# Altium schematic sheet CAN-INTERFACESchDoc.SchDoc
size A3; Organization: Altium Limited; Address1: L3, 12a Rodborough Rd; Address2: Frenchs Forest; Address3: NSW; Address4: Australia 2086
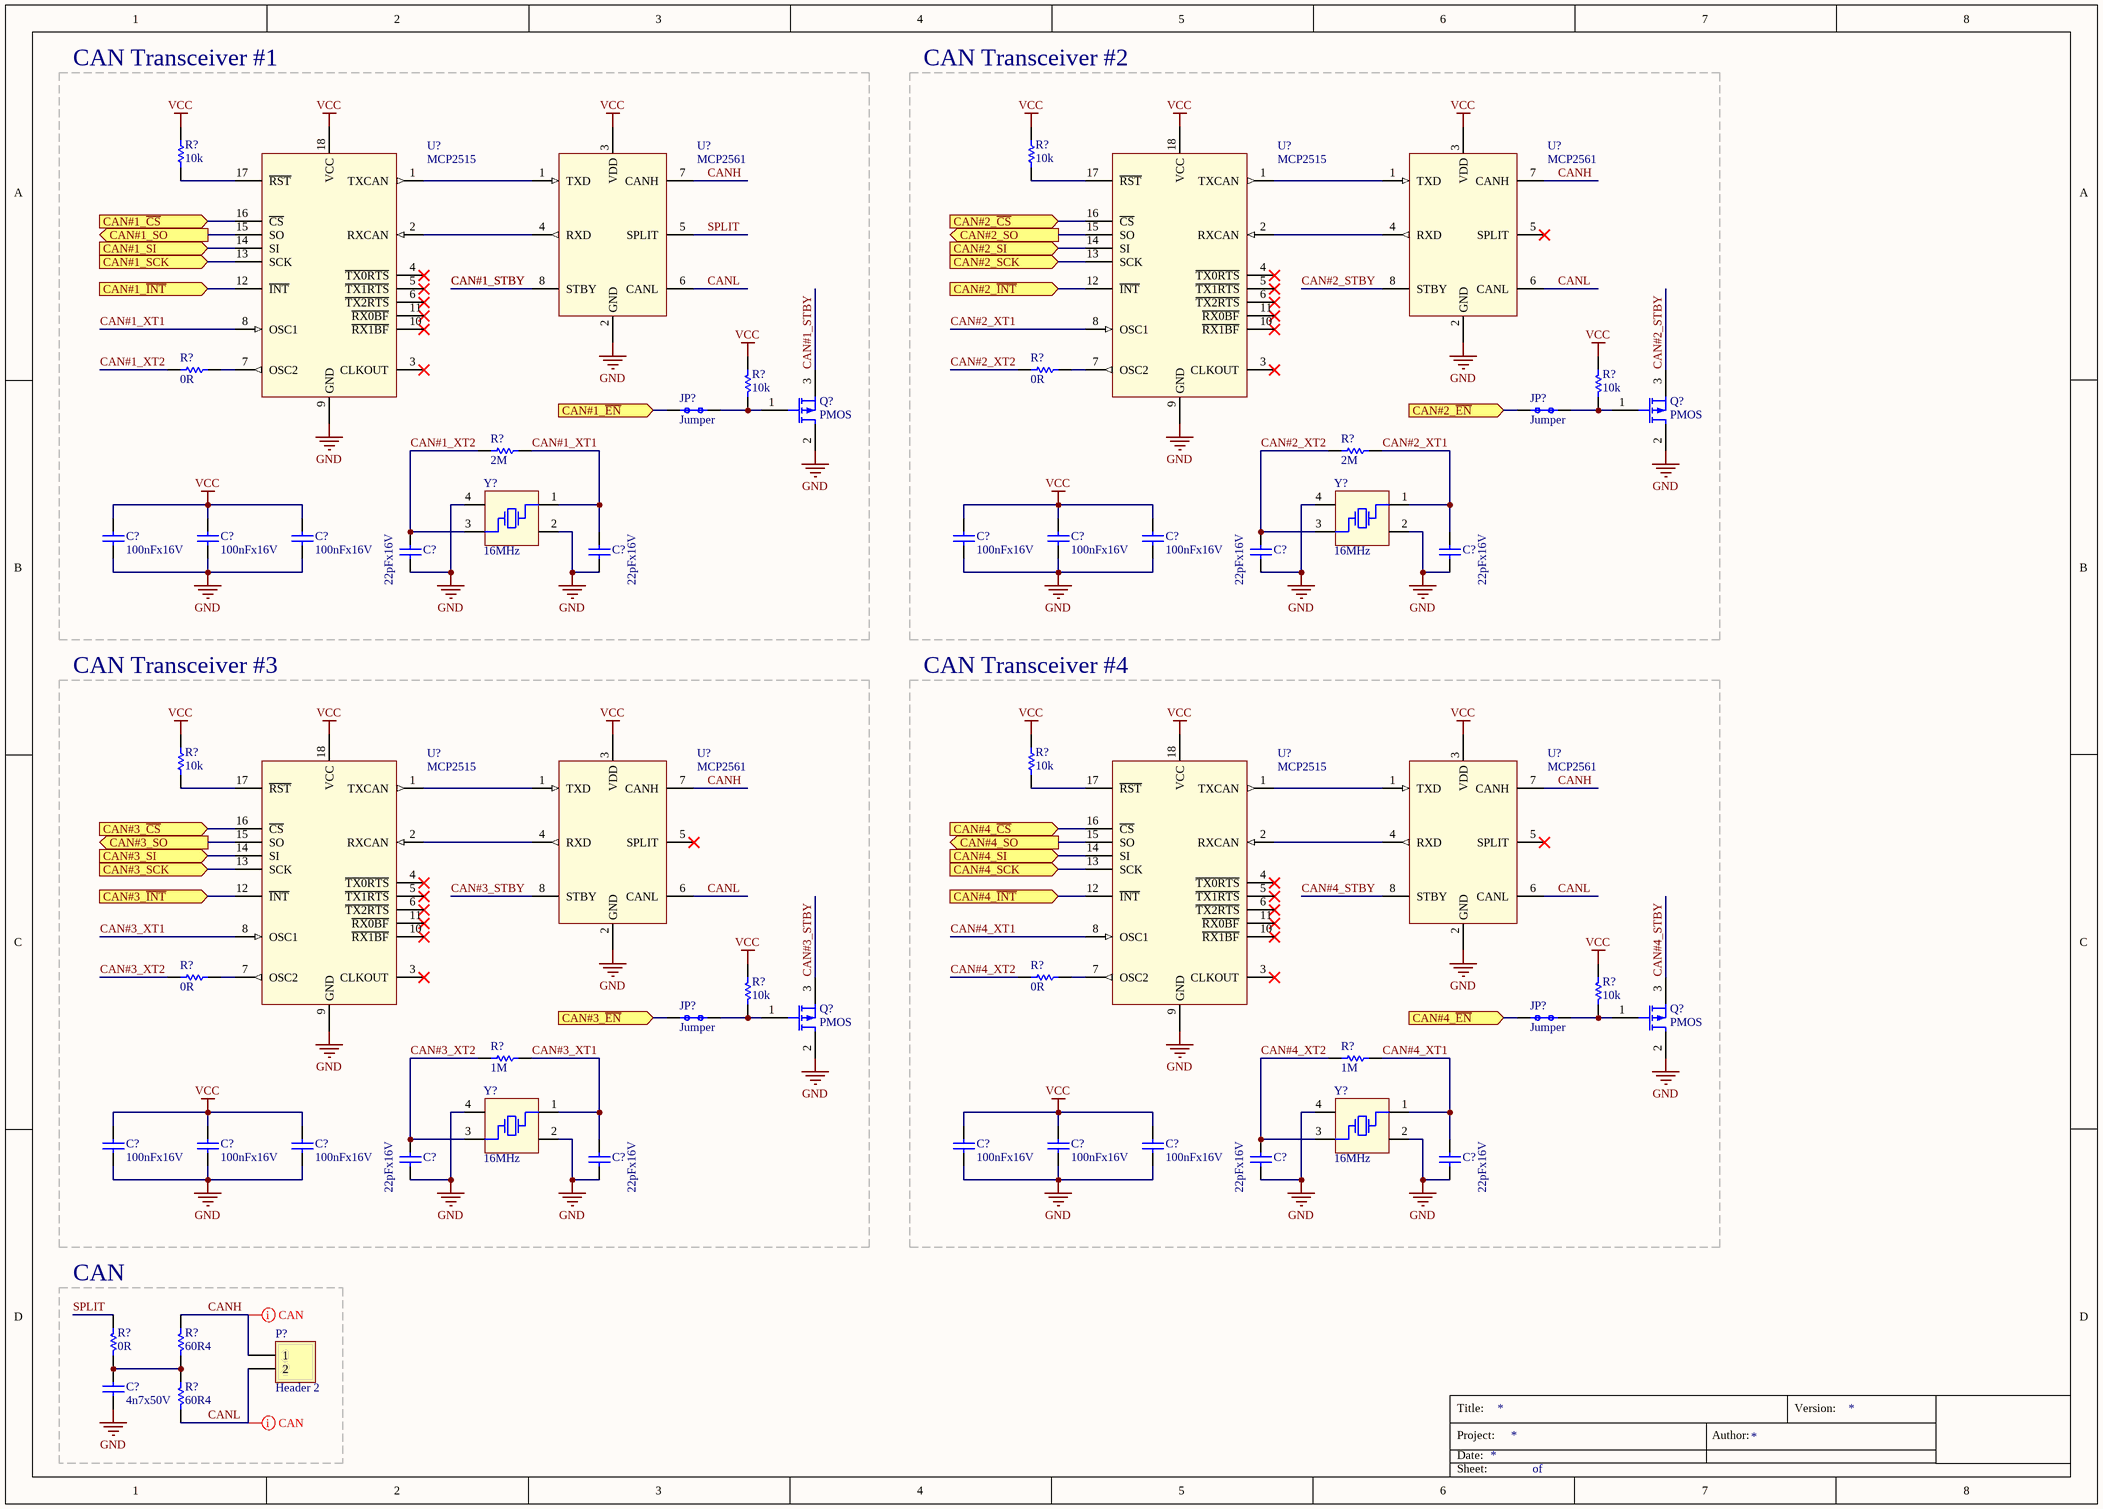
[diagram p0: CAN-INTERFACESchDoc.SchDoc]

## Parts
(Parts that share a designator on the sheet are numbered #1, #2 ... from top to bottom, then left to right.)
C?#1  100nFx16V  [DISC-0603]
C?#2  100nFx16V  [DISC-0603]
C?#3  100nFx16V  [DISC-0603]
C?#4  100nFx16V  [DISC-0603]
C?#5  100nFx16V  [DISC-0603]
C?#6  100nFx16V  [DISC-0603]
C?#7  22pFx16V  [DISC-0805]
C?#8  22pFx16V  [DISC-0805]
C?#9  22pFx16V  [DISC-0805]
C?#10  22pFx16V  [DISC-0805]
C?#11  100nFx16V  [DISC-0603]
C?#12  100nFx16V  [DISC-0603]
C?#13  100nFx16V  [DISC-0603]
C?#14  100nFx16V  [DISC-0603]
C?#15  100nFx16V  [DISC-0603]
C?#16  100nFx16V  [DISC-0603]
C?#17  22pFx16V  [DISC-0805]
C?#18  22pFx16V  [DISC-0805]
C?#19  22pFx16V  [DISC-0805]
C?#20  22pFx16V  [DISC-0805]
C?#21  4n7x50V  [DISC-0603]
JP?#1  Jumper  [CON-HEADER-1X2-PTH]
JP?#2  Jumper  [CON-HEADER-1X2-PTH]
JP?#3  Jumper  [CON-HEADER-1X2-PTH]
JP?#4  Jumper  [CON-HEADER-1X2-PTH]
P?  Header 2  [CON-BORNE-2]
Q?#1  PMOS  [DISC-SOT-23]
Q?#2  PMOS  [DISC-SOT-23]
Q?#3  PMOS  [DISC-SOT-23]
Q?#4  PMOS  [DISC-SOT-23]
R?#1  10k  [DISC-0603]
R?#2  10k  [DISC-0603]
R?#3  10k  [DISC-0603]
R?#4  10k  [DISC-0603]
R?#5  0R  [DISC-0603]
R?#6  0R  [DISC-0603]
R?#7  2M  [DISC-0805]
R?#8  2M  [DISC-0805]
R?#9  10k  [DISC-0603]
R?#10  10k  [DISC-0603]
R?#11  10k  [DISC-0603]
R?#12  10k  [DISC-0603]
R?#13  0R  [DISC-0603]
R?#14  0R  [DISC-0603]
R?#15  1M  [DISC-0805]
R?#16  1M  [DISC-0805]
R?#17  0R  [DISC-0603]
R?#18  60R4  [DISC-0805]
R?#19  60R4  [DISC-0805]
U?#1  MCP2515  [CI-SOICW-18]
U?#2  MCP2561  [CI-SOIC-8]
U?#3  MCP2515  [CI-SOICW-18]
U?#4  MCP2561  [CI-SOIC-8]
U?#5  MCP2515  [CI-SOICW-18]
U?#6  MCP2561  [CI-SOIC-8]
U?#7  MCP2515  [CI-SOICW-18]
U?#8  MCP2561  [CI-SOIC-8]
Y?#1  16MHz  [DISC-CRYSTAL-4P-3.2X2.5]
Y?#2  16MHz  [DISC-CRYSTAL-4P-3.2X2.5]
Y?#3  16MHz  [DISC-CRYSTAL-4P-3.2X2.5]
Y?#4  16MHz  [DISC-CRYSTAL-4P-3.2X2.5]

## Blocks framed on the sheet
CAN Transceiver #1: C?#1-C?#3 C?#7 C?#8 JP?#1 Q?#1 R?#1 R?#3 R?#5 R?#7 U?#1 U?#2 Y?#1
CAN Transceiver #2: C?#4-C?#6 C?#9 C?#10 JP?#2 Q?#2 R?#2 R?#4 R?#6 R?#8 U?#3 U?#4 Y?#2
CAN Transceiver #3: C?#11-C?#13 C?#17 C?#18 JP?#3 Q?#3 R?#9 R?#11 R?#13 R?#15 U?#5 U?#6 Y?#3
CAN Transceiver #4: C?#14-C?#16 C?#19 C?#20 JP?#4 Q?#4 R?#10 R?#12 R?#14 R?#16 U?#7 U?#8 Y?#4
CAN: C?#21 P? R?#17-R?#19

## Ports
CAN#1_SCK (in), CAN#1_SI (in), CAN#1_SO (out), CAN#1_~{CS} (in), CAN#1_~{EN} (in), CAN#1_~{INT} (in), CAN#2_SCK (in), CAN#2_SI (in), CAN#2_SO (out), CAN#2_~{CS} (in), CAN#2_~{EN} (in), CAN#2_~{INT} (in), CAN#3_SCK (in), CAN#3_SI (in), CAN#3_SO (out), CAN#3_~{CS} (in), CAN#3_~{EN} (in), CAN#3_~{INT} (in), CAN#4_SCK (in), CAN#4_SI (in), CAN#4_SO (out), CAN#4_~{CS} (in), CAN#4_~{EN} (in), CAN#4_~{INT} (in)

## Nets
GND: C?#1.2 C?#2.2 C?#3.2 C?#4.2 C?#5.2 C?#6.2 C?#7.1 C?#8.1 C?#9.1 C?#10.1 C?#11.2 C?#12.2 C?#13.2 C?#14.2 C?#15.2 C?#16.2 C?#17.1 C?#18.1 C?#19.1 C?#20.1 C?#21.1 Q?#1.2(D) Q?#2.2(D) Q?#3.2(D) Q?#4.2(D) U?#1.9(GND) U?#2.2(GND) U?#3.9(GND) U?#4.2(GND) U?#5.9(GND) U?#6.2(GND) U?#7.9(GND) U?#8.2(GND) Y?#1.2(GND) Y?#1.4(GND) Y?#2.2(GND) Y?#2.4(GND) Y?#3.2(GND) Y?#3.4(GND) Y?#4.2(GND) Y?#4.4(GND)
VCC: C?#1.1 C?#2.1 C?#3.1 C?#4.1 C?#5.1 C?#6.1 C?#11.1 C?#12.1 C?#13.1 C?#14.1 C?#15.1 C?#16.1 R?#1.1 R?#2.1 R?#3.1 R?#4.1 R?#9.1 R?#10.1 R?#11.1 R?#12.1 U?#1.18(VCC) U?#2.3(VDD) U?#3.18(VCC) U?#4.3(VDD) U?#5.18(VCC) U?#6.3(VDD) U?#7.18(VCC) U?#8.3(VDD)
CAN#1_~{CS}: U?#1.16(~{CS}) ; port CAN#1_~{CS}
CAN#1_~{EN}: JP?#1.2 ; port CAN#1_~{EN}
CAN#1_~{INT}: U?#1.12(~{INT}) ; port CAN#1_~{INT}
CAN#1_SCK: U?#1.13(SCK) ; port CAN#1_SCK
CAN#1_SI: U?#1.14(SI) ; port CAN#1_SI
CAN#1_SO: U?#1.15(SO) ; port CAN#1_SO
CAN#1_STBY: Q?#1.3(S) U?#2.8(STBY)
CAN#1_XT1: C?#8.2 R?#7.2 U?#1.8(OSC1) Y?#1.1(OSC1)
CAN#1_XT2: C?#7.2 R?#5.2 R?#7.1 Y?#1.3(OSC2)
CAN#2_~{CS}: U?#3.16(~{CS}) ; port CAN#2_~{CS}
CAN#2_~{EN}: JP?#2.2 ; port CAN#2_~{EN}
CAN#2_~{INT}: U?#3.12(~{INT}) ; port CAN#2_~{INT}
CAN#2_SCK: U?#3.13(SCK) ; port CAN#2_SCK
CAN#2_SI: U?#3.14(SI) ; port CAN#2_SI
CAN#2_SO: U?#3.15(SO) ; port CAN#2_SO
CAN#2_STBY: Q?#2.3(S) U?#4.8(STBY)
CAN#2_XT1: C?#10.2 R?#8.2 U?#3.8(OSC1) Y?#2.1(OSC1)
CAN#2_XT2: C?#9.2 R?#6.2 R?#8.1 Y?#2.3(OSC2)
CAN#3_~{CS}: U?#5.16(~{CS}) ; port CAN#3_~{CS}
CAN#3_~{EN}: JP?#3.2 ; port CAN#3_~{EN}
CAN#3_~{INT}: U?#5.12(~{INT}) ; port CAN#3_~{INT}
CAN#3_SCK: U?#5.13(SCK) ; port CAN#3_SCK
CAN#3_SI: U?#5.14(SI) ; port CAN#3_SI
CAN#3_SO: U?#5.15(SO) ; port CAN#3_SO
CAN#3_STBY: Q?#3.3(S) U?#6.8(STBY)
CAN#3_XT1: C?#18.2 R?#15.2 U?#5.8(OSC1) Y?#3.1(OSC1)
CAN#3_XT2: C?#17.2 R?#13.2 R?#15.1 Y?#3.3(OSC2)
CAN#4_~{CS}: U?#7.16(~{CS}) ; port CAN#4_~{CS}
CAN#4_~{EN}: JP?#4.2 ; port CAN#4_~{EN}
CAN#4_~{INT}: U?#7.12(~{INT}) ; port CAN#4_~{INT}
CAN#4_SCK: U?#7.13(SCK) ; port CAN#4_SCK
CAN#4_SI: U?#7.14(SI) ; port CAN#4_SI
CAN#4_SO: U?#7.15(SO) ; port CAN#4_SO
CAN#4_STBY: Q?#4.3(S) U?#8.8(STBY)
CAN#4_XT1: C?#20.2 R?#16.2 U?#7.8(OSC1) Y?#4.1(OSC1)
CAN#4_XT2: C?#19.2 R?#14.2 R?#16.1 Y?#4.3(OSC2)
CANH: P?.1 R?#18.2 U?#2.7(CANH) U?#4.7(CANH) U?#6.7(CANH) U?#8.7(CANH)
CANL: P?.2 R?#19.1 U?#2.6(CANL) U?#4.6(CANL) U?#6.6(CANL) U?#8.6(CANL)
SPLIT: R?#17.1 U?#2.5(SPLIT)
NetC?#21_2: C?#21.2 R?#17.2 R?#18.1 R?#19.2
NetJP?#1_1: JP?#1.1 Q?#1.1(G) R?#3.2
NetJP?#2_1: JP?#2.1 Q?#2.1(G) R?#4.2
NetJP?#3_1: JP?#3.1 Q?#3.1(G) R?#11.2
NetJP?#4_1: JP?#4.1 Q?#4.1(G) R?#12.2
NetR?#1_2: R?#1.2 U?#1.17(~{RST})
NetR?#2_2: R?#2.2 U?#3.17(~{RST})
NetR?#5_1: R?#5.1 U?#1.7(OSC2)
NetR?#6_1: R?#6.1 U?#3.7(OSC2)
NetR?#9_2: R?#9.2 U?#5.17(~{RST})
NetR?#10_2: R?#10.2 U?#7.17(~{RST})
NetR?#13_1: R?#13.1 U?#5.7(OSC2)
NetR?#14_1: R?#14.1 U?#7.7(OSC2)
NetU?#1_1: U?#1.1(TXCAN) U?#2.1(TXD)
NetU?#1_2: U?#1.2(RXCAN) U?#2.4(RXD)
NetU?#3_1: U?#3.1(TXCAN) U?#4.1(TXD)
NetU?#3_2: U?#3.2(RXCAN) U?#4.4(RXD)
NetU?#5_1: U?#5.1(TXCAN) U?#6.1(TXD)
NetU?#5_2: U?#5.2(RXCAN) U?#6.4(RXD)
NetU?#7_1: U?#7.1(TXCAN) U?#8.1(TXD)
NetU?#7_2: U?#7.2(RXCAN) U?#8.4(RXD)

Not connected (* = marked no-connect by the designer): U?#1 3(CLKOUT)* 4(~{TX0RTS})* 5(~{TX1RTS})* 6(~{TX2RTS})* 10(~{RX1BF})* 11(~{RX0BF})*; U?#3 3(CLKOUT)* 4(~{TX0RTS})* 5(~{TX1RTS})* 6(~{TX2RTS})* 10(~{RX1BF})* 11(~{RX0BF})*; U?#4 5(SPLIT)*; U?#5 3(CLKOUT)* 4(~{TX0RTS})* 5(~{TX1RTS})* 6(~{TX2RTS})* 10(~{RX1BF})* 11(~{RX0BF})*; U?#6 5(SPLIT)*; U?#7 3(CLKOUT)* 4(~{TX0RTS})* 5(~{TX1RTS})* 6(~{TX2RTS})* 10(~{RX1BF})* 11(~{RX0BF})*; U?#8 5(SPLIT)*

## Layout directives
differential pair: CANH, CANL

## Notes on the sheet
- Title:
- Project:
- Date:
- Author:
- Version:
- Sheet:
- of

## Library data of the parts
C?#1-C?#21 = Cap: Capacitor
JP?#1-JP?#4 = Jumper: Resistor
P? = Header 2: Header, 2-Pin; LatestRevisionDate: 17-Jul-2002; LatestRevisionNote: Re-released for DXP Platform.; Publisher: Altium Limited
Q?#1-Q?#4 = Transistor-PMOS: P-Channel MOSFET
R?#1-R?#17 = Res: Resistor
R?#18 R?#19 = Res
U?#1 U?#3 U?#5 U?#7 = MCP2515: Stand-Alone CAN Controller With SPI Interface
U?#2 U?#4 U?#6 U?#8 = MCP2561: High speed CAN transceiver
Y?#1-Y?#4 = XTAL-4-PIN